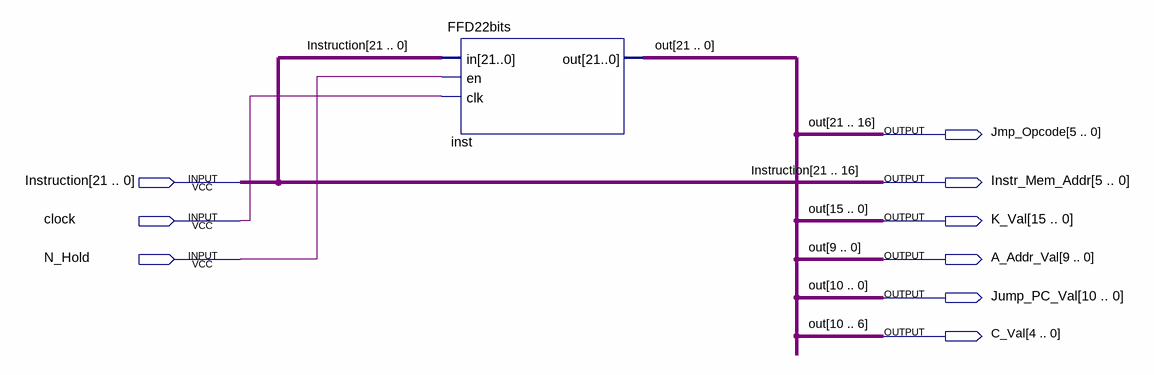
[diagram p0: schematic sheet]
// Quartus schematic Instr_Separator.bdf as structural Verilog: 1 symbols, 9 pins
module Instr_Separator (
  input  [21:0] Instruction,
  input  clock,
  input  N_Hold,
  output [5:0] Jmp_Opcode,
  output [5:0] Instr_Mem_Addr,
  output [15:0] K_Val,
  output [9:0] A_Addr_Val,
  output [10:0] Jump_PC_Val,
  output [4:0] C_Val
);

  FFD22bits inst (.in(Instruction), .en(N_Hold), .clk(clock), .out({Jmp_Opcode, K_Val[15:11], C_Val[4], A_Addr_Val}));

  assign C_Val[3:0] = A_Addr_Val[9:6];
  assign Instr_Mem_Addr = Instruction[21:16];
  assign Jump_PC_Val = {C_Val[4], A_Addr_Val};
  assign K_Val[10:0] = {C_Val[4], A_Addr_Val};

  // Other names for the same wires on the sheet: out[21:0] = {Jmp_Opcode, K_Val[15:11], C_Val[4], A_Addr_Val}
endmodule
